# Altium schematic sheet 04 POWER.SchDoc
size 420 x 297 mm; Address1: Address1; Address2: Address2; Address3: Address3; Address4: Address4; DocumentNumber: АБВГ.123456.001 Э3; SheetNumber: 4; SheetTotal: 23; Scale: 1:1; DocumentType: Схема электрическая принципиальная; FirstReferrence: АБВГ.123456.001
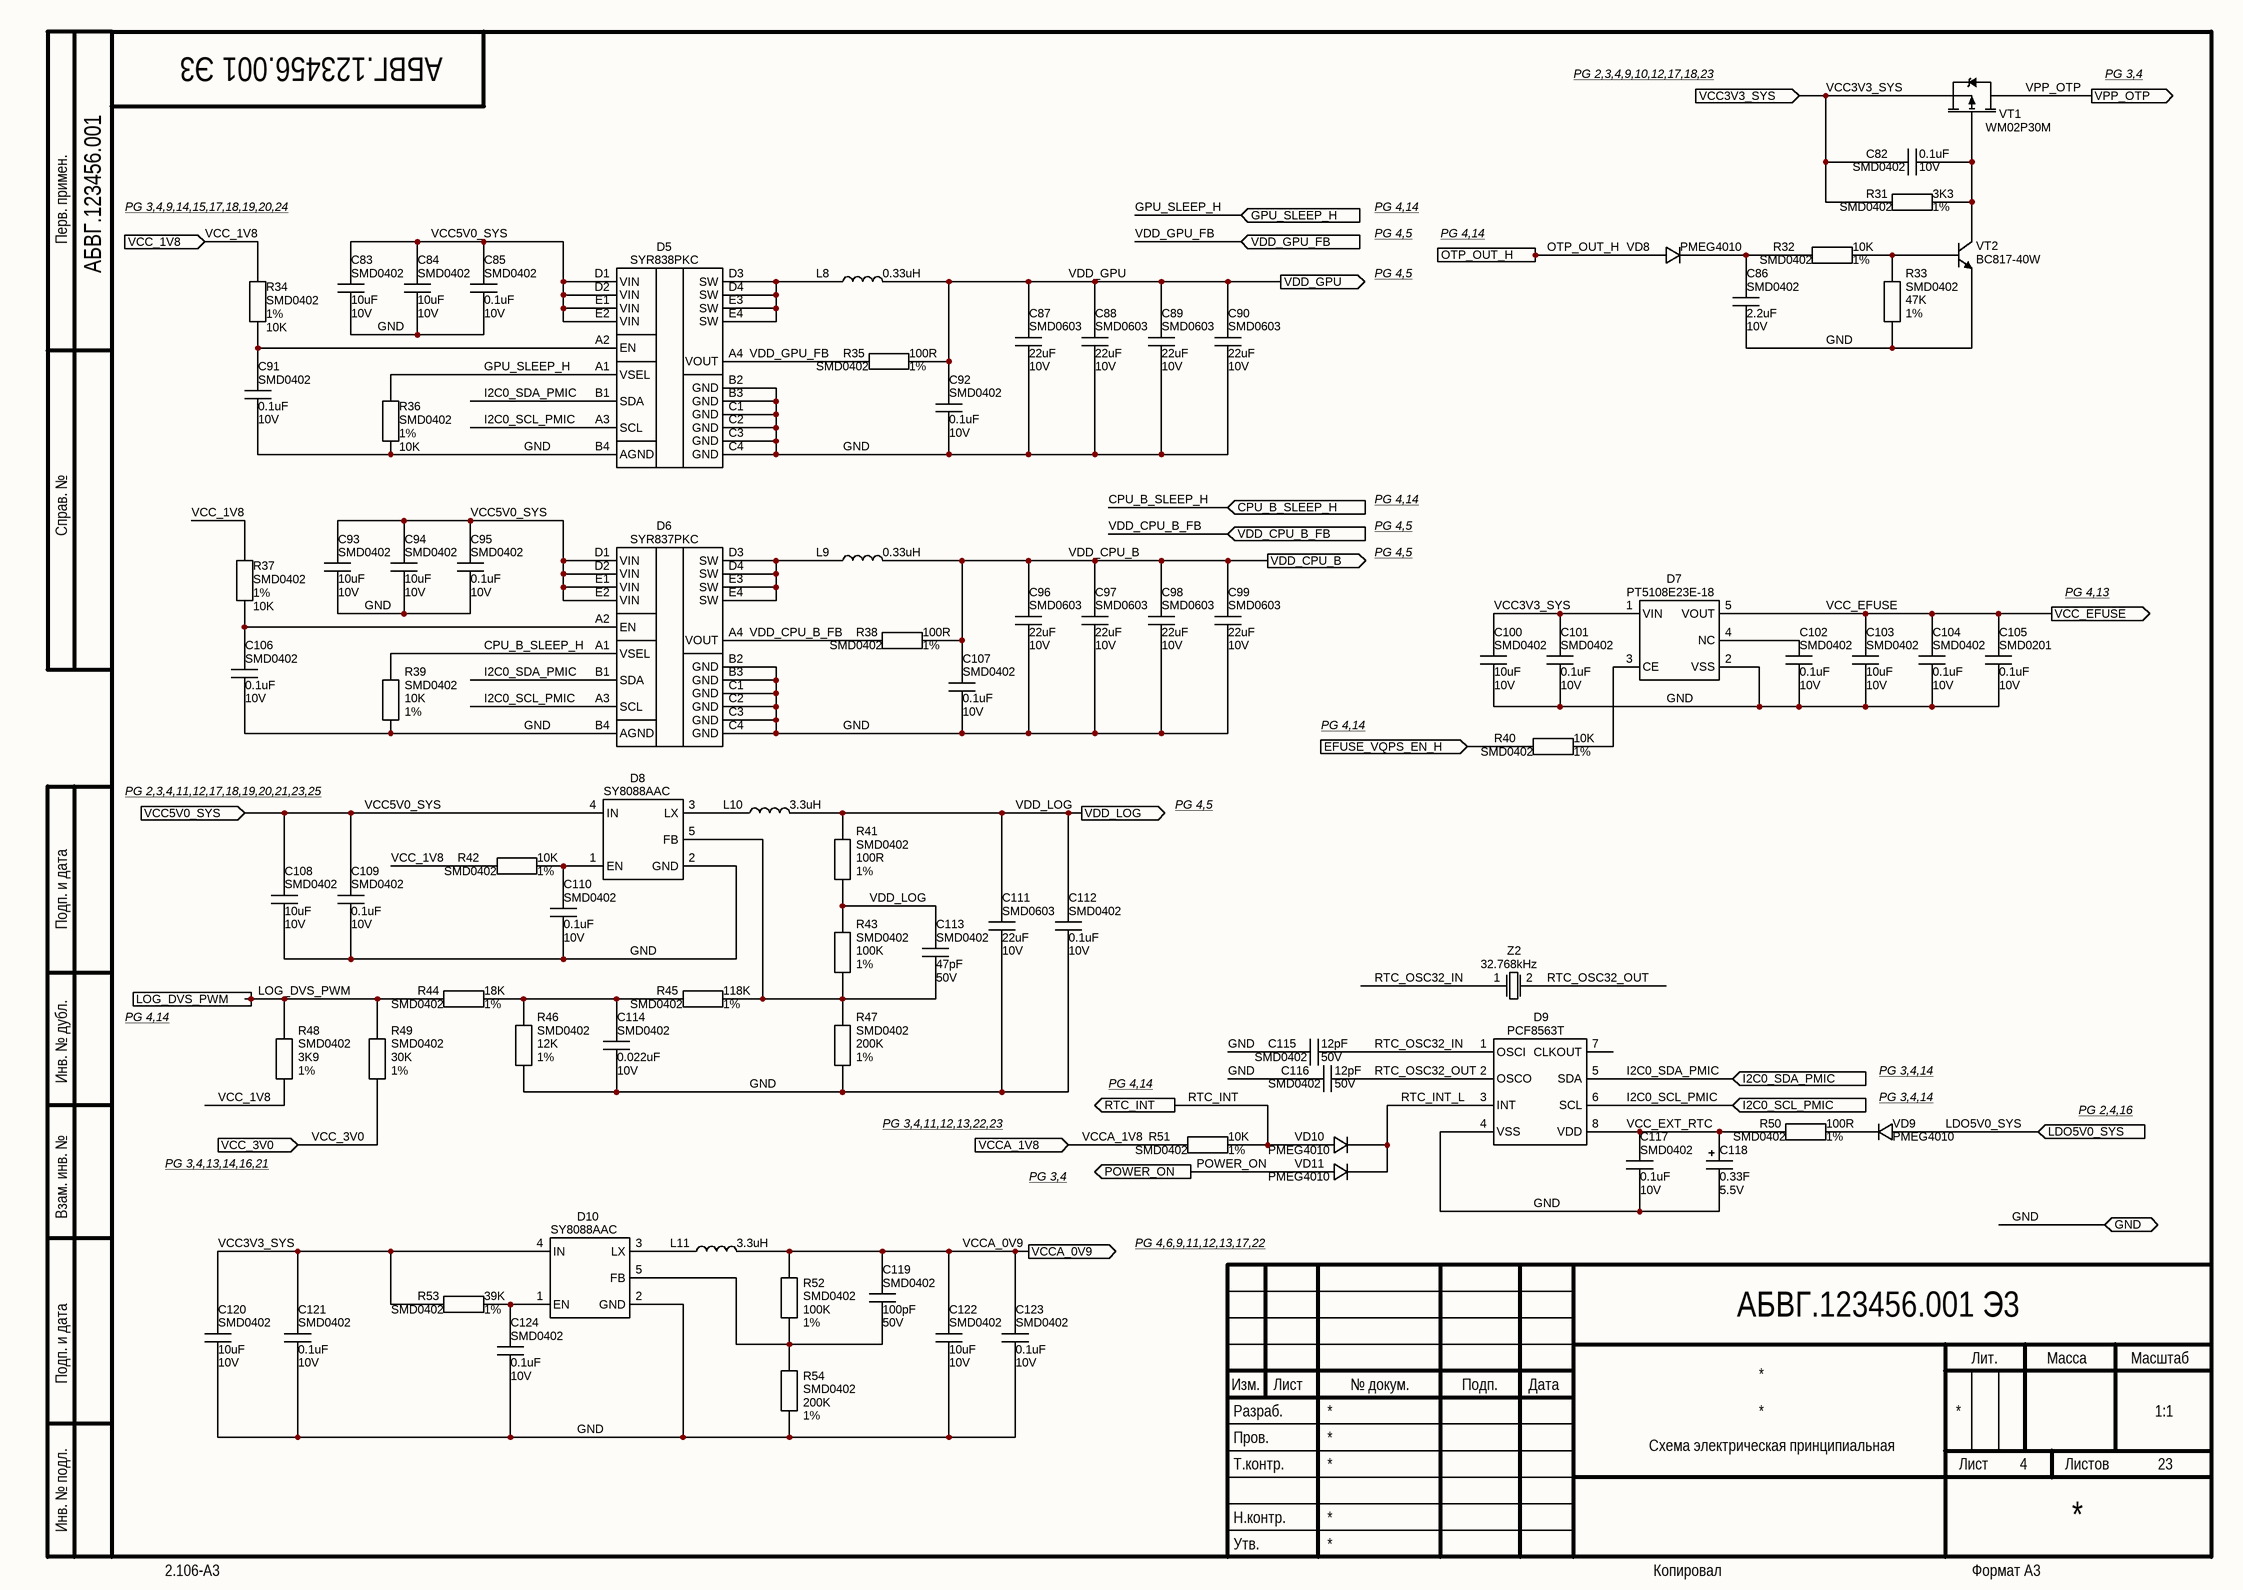
[diagram p0: 04 POWER.SchDoc]

## Parts
C82  Package: SMD0402  Voltage: 10V  [CAP_SMD_0402]  (hidden comment: 0.1uF)
C83  Package: SMD0402  Voltage: 10V  [CAP_SMD_0402]  (hidden comment: 10uF)
C84  Package: SMD0402  Voltage: 10V  [CAP_SMD_0402]  (hidden comment: 10uF)
C85  Package: SMD0402  Voltage: 10V  [CAP_SMD_0402]  (hidden comment: 0.1uF)
C86  Package: SMD0402  Voltage: 10V  [CAP_SMD_0402]  (hidden comment: 2.2uF)
C87  Package: SMD0603  Voltage: 10V  [CAP_SMD_0603]  (hidden comment: 22uF)
C88  Package: SMD0603  Voltage: 10V  [CAP_SMD_0603]  (hidden comment: 22uF)
C89  Package: SMD0603  Voltage: 10V  [CAP_SMD_0603]  (hidden comment: 22uF)
C90  Package: SMD0603  Voltage: 10V  [CAP_SMD_0603]  (hidden comment: 22uF)
C91  Package: SMD0402  Voltage: 10V  [CAP_SMD_0402]  (hidden comment: 0.1uF)
C92  Package: SMD0402  Voltage: 10V  [CAP_SMD_0402]  (hidden comment: 0.1uF)
C93  Package: SMD0402  Voltage: 10V  [CAP_SMD_0402]  (hidden comment: 10uF)
C94  Package: SMD0402  Voltage: 10V  [CAP_SMD_0402]  (hidden comment: 10uF)
C95  Package: SMD0402  Voltage: 10V  [CAP_SMD_0402]  (hidden comment: 0.1uF)
C96  Package: SMD0603  Voltage: 10V  [CAP_SMD_0603]  (hidden comment: 22uF)
C97  Package: SMD0603  Voltage: 10V  [CAP_SMD_0603]  (hidden comment: 22uF)
C98  Package: SMD0603  Voltage: 10V  [CAP_SMD_0603]  (hidden comment: 22uF)
C99  Package: SMD0603  Voltage: 10V  [CAP_SMD_0603]  (hidden comment: 22uF)
C100  Package: SMD0402  Voltage: 10V  [CAP_SMD_0402]  (hidden comment: 10uF)
C101  Package: SMD0402  Voltage: 10V  [CAP_SMD_0402]  (hidden comment: 0.1uF)
C102  Package: SMD0402  Voltage: 10V  [CAP_SMD_0402]  (hidden comment: 0.1uF)
C103  Package: SMD0402  Voltage: 10V  [CAP_SMD_0402]  (hidden comment: 10uF)
C104  Package: SMD0402  Voltage: 10V  [CAP_SMD_0402]  (hidden comment: 0.1uF)
C105  Package: SMD0201  Voltage: 10V  [CAP_SMD_0201]  (hidden comment: 0.1uF)
C106  Package: SMD0402  Voltage: 10V  [CAP_SMD_0402]  (hidden comment: 0.1uF)
C107  Package: SMD0402  Voltage: 10V  [CAP_SMD_0402]  (hidden comment: 0.1uF)
C108  Package: SMD0402  Voltage: 10V  [CAP_SMD_0402]  (hidden comment: 10uF)
C109  Package: SMD0402  Voltage: 10V  [CAP_SMD_0402]  (hidden comment: 0.1uF)
C110  Package: SMD0402  Voltage: 10V  [CAP_SMD_0402]  (hidden comment: 0.1uF)
C111  Package: SMD0603  Voltage: 10V  [CAP_SMD_0603]  (hidden comment: 22uF)
C112  Package: SMD0402  Voltage: 10V  [CAP_SMD_0402]  (hidden comment: 0.1uF)
C113  Package: SMD0402  Voltage: 50V  [CAP_SMD_0402]  (hidden comment: 47pF)
C114  Package: SMD0402  Voltage: 10V  [CAP_SMD_0402]  (hidden comment: 0.022uF)
C115  Package: SMD0402  Voltage: 50V  [CAP_SMD_0402]  (hidden comment: 12pF)
C116  Package: SMD0402  Voltage: 50V  [CAP_SMD_0402]  (hidden comment: 12pF)
C117  Package: SMD0402  Voltage: 10V  [CAP_SMD_0402]  (hidden comment: 0.1uF)
C118  Voltage: 5.5V  [DCS5R5_H]  (hidden comment: 0.33F)
C119  Package: SMD0402  Voltage: 50V  [CAP_SMD_0402]  (hidden comment: 100pF)
C120  Package: SMD0402  Voltage: 10V  [CAP_SMD_0402]  (hidden comment: 10uF)
C121  Package: SMD0402  Voltage: 10V  [CAP_SMD_0402]  (hidden comment: 0.1uF)
C122  Package: SMD0402  Voltage: 10V  [CAP_SMD_0402]  (hidden comment: 10uF)
C123  Package: SMD0402  Voltage: 10V  [CAP_SMD_0402]  (hidden comment: 0.1uF)
C124  Package: SMD0402  Voltage: 10V  [CAP_SMD_0402]  (hidden comment: 0.1uF)
D5  SYR838PKC  [WLCSP-20]
D6  SYR837PKC  [WLCSP-20]
D7  PT5108E23E-18  [SOT23-5]
D8  SY8088AAC  [SOT23-5]
D9  PCF8563T  [SO8]
D10  SY8088AAC  [SOT23-5]
L8  value 0.33uH  [HEI252012A]  (hidden comment: Value)
L9  value 0.33uH  [HEI252012A]  (hidden comment: Value)
L10  value 3.3uH  [HEI252012A]  (hidden comment: Value)
L11  value 3.3uH  [HEI252012A]  (hidden comment: Value)
R31  Package: SMD0402  Tolerance: 1%  [RES_SMD_0402]  (hidden comment: 3K3)
R32  Package: SMD0402  Tolerance: 1%  [RES_SMD_0402]  (hidden comment: 10K)
R33  Package: SMD0402  Tolerance: 1%  [RES_SMD_0402]  (hidden comment: 47K)
R34  Package: SMD0402  Tolerance: 1%  [RES_SMD_0402]  (hidden comment: 10K)
R35  Package: SMD0402  Tolerance: 1%  [RES_SMD_0402]  (hidden comment: 100R)
R36  Package: SMD0402  Tolerance: 1%  [RES_SMD_0402]  (hidden comment: 10K)
R37  Package: SMD0402  Tolerance: 1%  [RES_SMD_0402]  (hidden comment: 10K)
R38  Package: SMD0402  Tolerance: 1%  [RES_SMD_0402]  (hidden comment: 100R)
R39  Package: SMD0402  Tolerance: 1%  [RES_SMD_0402]  (hidden comment: 10K)
R40  Package: SMD0402  Tolerance: 1%  [RES_SMD_0402]  (hidden comment: 10K)
R41  Package: SMD0402  Tolerance: 1%  [RES_SMD_0402]  (hidden comment: 100R)
R42  Package: SMD0402  Tolerance: 1%  [RES_SMD_0402]  (hidden comment: 10K)
R43  Package: SMD0402  Tolerance: 1%  [RES_SMD_0402]  (hidden comment: 100K)
R44  Package: SMD0402  Tolerance: 1%  [RES_SMD_0402]  (hidden comment: 18K)
R45  Package: SMD0402  Tolerance: 1%  [RES_SMD_0402]  (hidden comment: 118K)
R46  Package: SMD0402  Tolerance: 1%  [RES_SMD_0402]  (hidden comment: 12K)
R47  Package: SMD0402  Tolerance: 1%  [RES_SMD_0402]  (hidden comment: 200K)
R48  Package: SMD0402  Tolerance: 1%  [RES_SMD_0402]  (hidden comment: 3K9)
R49  Package: SMD0402  Tolerance: 1%  [RES_SMD_0402]  (hidden comment: 30K)
R50  Package: SMD0402  Tolerance: 1%  [RES_SMD_0402]  (hidden comment: 100R)
R51  Package: SMD0402  Tolerance: 1%  [RES_SMD_0402]  (hidden comment: 10K)
R52  Package: SMD0402  Tolerance: 1%  [RES_SMD_0402]  (hidden comment: 100K)
R53  Package: SMD0402  Tolerance: 1%  [RES_SMD_0402]  (hidden comment: 39K)
R54  Package: SMD0402  Tolerance: 1%  [RES_SMD_0402]  (hidden comment: 200K)
VD8  value PMEG4010  [SOD323]  (hidden comment: Diode)
VD9  value PMEG4010  [SOD323]  (hidden comment: Diode)
VD10  value PMEG4010  [SOD323]  (hidden comment: Diode)
VD11  value PMEG4010  [SOD323]  (hidden comment: Diode)
VT1  value WM02P30M  [SOT23]  (hidden comment: Value)
VT2  BC817-40W  [SC-70]
Z2  value 32.768kHz  [TSX3215]  (hidden comment: Value)

## Ports
CPU_B_SLEEP_H (in), EFUSE_VQPS_EN_H (in), GND (bidir), GPU_SLEEP_H (in), I2C0_SCL_PMIC (in), I2C0_SDA_PMIC (in), LDO5V0_SYS (in), LOG_DVS_PWM (in), OTP_OUT_H (in), POWER_ON (out), RTC_INT (out), VCC3V3_SYS (in), VCC5V0_SYS (in), VCC_1V8 (in), VCC_3V0 (in), VCC_EFUSE (out), VCCA_0V9 (out), VCCA_1V8 (in), VDD_CPU_B (out), VDD_CPU_B_FB (in), VDD_GPU (out), VDD_GPU_FB (in), VDD_LOG (out), VPP_OTP (out)

## Nets
CPU_B_SLEEP_H: D6.A1(VSEL) R39.2 ; port CPU_B_SLEEP_H
EFUSE_VQPS_EN_H: R40.2 ; port EFUSE_VQPS_EN_H
GND: C83.2 C84.2 C85.2 C86.1 C87.1 C88.1 C89.1 C90.1 C91.2 C92.2 C93.2 C94.2 C95.2 C96.1 C97.1 C98.1 C99.1 C100.2 C101.2 C102.2 C103.2 C104.2 C105.2 C106.2 C107.2 C108.2 C109.2 C110.2 C111.1 C112.2 C114.2 C115.2 C116.2 C117.2 C118.2 C120.2 C121.2 C122.2 C123.2 C124.2 D5.B2(GND) D5.B3(GND) D5.B4(AGND) D5.C1(GND) D5.C2(GND) D5.C3(GND) D5.C4(GND) D6.B2(GND) D6.B3(GND) D6.B4(AGND) D6.C1(GND) D6.C2(GND) D6.C3(GND) D6.C4(GND) D7.2(VSS) D8.2(GND) D9.4(VSS) D10.2(GND) R33.1 R36.1 R39.1 R46.1 R47.1 R54.1 VT2.2(E) ; port GND
GPU_SLEEP_H: D5.A1(VSEL) R36.2 ; port GPU_SLEEP_H
I2C0_SCL_PMIC: D5.A3(SCL) D6.A3(SCL) D9.6(SCL) ; port I2C0_SCL_PMIC
I2C0_SDA_PMIC: D5.B1(SDA) D6.B1(SDA) D9.5(SDA) ; port I2C0_SDA_PMIC
LDO5V0_SYS: VD9.1(A) ; port LDO5V0_SYS
LOG_DVS_PWM: R44.1 R48.2 R49.2 ; port LOG_DVS_PWM
OTP_OUT_H: VD8.1(A) ; port OTP_OUT_H
POWER_ON: VD11.1(A) ; port POWER_ON
RTC_INT: R51.1 VD10.1(A) ; port RTC_INT
RTC_INT_L: D9.3(INT) VD10.2(C) VD11.2(C)
RTC_OSC32_IN: C115.1 D9.1(OSCI) Z2.1
RTC_OSC32_OUT: C116.1 D9.2(OSCO) Z2.2
VCC3V3_SYS: C82.1 C100.1 C101.1 C120.1 C121.1 D7.1(VIN) D10.4(IN) R31.1 R53.1 VT1.2(S) ; port VCC3V3_SYS
VCC5V0_SYS: C83.1 C84.1 C85.1 C93.1 C94.1 C95.1 C108.1 C109.1 D5.D1(VIN) D5.D2(VIN) D5.E1(VIN) D5.E2(VIN) D6.D1(VIN) D6.D2(VIN) D6.E1(VIN) D6.E2(VIN) D8.4(IN) ; port VCC5V0_SYS
VCC_1V8: R34.2 R37.2 R42.2 R48.1 ; port VCC_1V8
VCC_3V0: R49.1 ; port VCC_3V0
VCC_EFUSE: C103.1 C104.1 C105.1 D7.5(VOUT) ; port VCC_EFUSE
VCC_EXT_RTC: C117.1 C118.1 D9.8(VDD) R50.1
VCCA_0V9: C119.1 C122.1 C123.1 L11.1 R52.2 ; port VCCA_0V9
VCCA_1V8: R51.2 ; port VCCA_1V8
VDD_CPU_B: C96.2 C97.2 C98.2 C99.2 C107.1 L9.1 R38.2 ; port VDD_CPU_B
VDD_CPU_B_FB: D6.A4(VOUT) R38.1 ; port VDD_CPU_B_FB
VDD_GPU: C87.2 C88.2 C89.2 C90.2 C92.1 L8.1 R35.2 ; port VDD_GPU
VDD_GPU_FB: D5.A4(VOUT) R35.1 ; port VDD_GPU_FB
VDD_LOG: C111.2 C112.1 C113.1 L10.1 R41.1 R41.2 R43.2 ; port VDD_LOG
VPP_OTP: VT1.3(D) ; port VPP_OTP
NetC82_2: C82.2 R31.2 VT1.1(G) VT2.3(C)
NetC86_2: C86.2 R32.2 VD8.2(C)
NetC91_1: C91.1 D5.A2(EN) R34.1
NetC102_1: C102.1 D7.4(NC)
NetC106_1: C106.1 D6.A2(EN) R37.1
NetC110_1: C110.1 D8.1(EN) R42.1
NetC113_2: C113.2 D8.5(FB) R43.1 R45.2 R47.2
NetC114_1: C114.1 R44.2 R45.1 R46.2
NetC119_2: C119.2 D10.5(FB) R52.1 R54.2
NetC124_1: C124.1 D10.1(EN) R53.2
NetD5_D3: D5.D3(SW) D5.D4(SW) D5.E3(SW) D5.E4(SW) L8.2
NetD6_D3: D6.D3(SW) D6.D4(SW) D6.E3(SW) D6.E4(SW) L9.2
NetD7_3: D7.3(CE) R40.1
NetD8_3: D8.3(LX) L10.2
NetD10_3: D10.3(LX) L11.2
NetR32_1: R32.1 R33.2 VT2.1(B)
NetR50_2: R50.2 VD9.2(C)

Not connected (* = marked no-connect by the designer): D9 7(CLKOUT)

## Notes on the sheet
- PG 2,3,4,9,10,12,17,18,23
- PG 3,4
- Перв. примен.
- PG 3,4,9,14,15,17,18,19,20,24
- PG 4,14
- PG 4,5
- Справ. №
- PG 4,13
- PG 2,3,4,11,12,17,18,19,20,21,23,25
- Подп. и дата
- Инв. № дубл.
- PG 3,4,11,12,13,22,23
- PG 3,4,14
- (near VD9) PG 3,4,14
- PG 2,4,16
- PG 3,4,13,14,16,21
- Взам. инв. №
- PG 4,6,9,11,12,13,17,22
- Разраб.
- Изм.
- Лист
- № докум.
- Подп.
- Дата
- Лит.
- Масса
- Масштаб
- Пров.
- Т.контр.
- Листов
- Инв. № подл.
- Утв.
- Н.контр.
- 2.106-A3
- Копировал
- Формат А3

## Library data of the parts
C82 C85 C91 C92 C95 C101 C102 C104 C106 C107 C109 C110 C112 C117 C121 C123 C124 = Ceramic_Cap: PartNumber: CC0402KRX5R6BB104; ComponentType: SMD Ceramic Chip Capacitor; Manufacter: *; Tolerance: *; ClassName: *; Value: 0.1uF
C83 C84 C93 C94 C100 C103 C108 C120 C122 = Ceramic_Cap: PartNumber: CC0402MRX5R6BB106; ComponentType: SMD Ceramic Chip Capacitor; Manufacter: *; Tolerance: *; ClassName: *; Value: 10uF
C86 = Ceramic_Cap: PartNumber: CC0402KRX5R6BB225; ComponentType: SMD Ceramic Chip Capacitor; Manufacter: *; Tolerance: *; ClassName: *; Value: 2.2uF
C87-C90 C96-C99 C111 = Ceramic_Cap: PartNumber: CL10A226MP8NUNE; ComponentType: SMD Ceramic Chip Capacitor; Manufacter: *; Tolerance: *; ClassName: *; Value: 22uF
C105 = Ceramic_Cap: PartNumber: CC0201KRX5R6BB104; ComponentType: SMD Ceramic Chip Capacitor; Manufacter: *; Tolerance: *; ClassName: *; Value: 0.1uF
C113 = Ceramic_Cap: PartNumber: CC0402FRNPO9BN470; ComponentType: SMD Ceramic Chip Capacitor; Manufacter: *; Tolerance: *; ClassName: *; Value: 47pF
C114 = Ceramic_Cap: PartNumber: GRM155R61A223KA01D; ComponentType: SMD Ceramic Chip Capacitor; Manufacter: *; Tolerance: *; ClassName: *; Value: 0.022uF
C115 C116 = Ceramic_Cap: PartNumber: CC0402JRNPO9BN120; ComponentType: SMD Ceramic Chip Capacitor; Manufacter: *; Tolerance: *; ClassName: *; Value: 12pF
C118 = AluminiumCap: PartNumber: DCS5R5334HF; Tolerance: ±20%; Manufacturer: *; Package: DCS5R5_H; ComponentType: *; ClassName: *; Value: 0.33F
C119 = Ceramic_Cap: PartNumber: CC0402KRNPO9BN101; ComponentType: SMD Ceramic Chip Capacitor; Manufacter: *; Tolerance: *; ClassName: *; Value: 100pF
D6 = SYR838PKC: ComponentType: SMD Chip Resistor; Manufacter: *; Voltage: *; ClassName: *; Tolerance: *; PartNumber: SYR837PKC; Package: WLCSP-20; Value: SYR837PKC
D7 = PT5108E23E-30: ComponentType: SMD Chip Resistor; Manufacter: *; Voltage: *; ClassName: *; Tolerance: *; PartNumber: PT5108E23E-18; Package: SOT23-5; Value: PT5108E23E-18
L8 L9 = Inductor_smal: PartNumber: HEI252012A-R33M-Q8; ComponentType: *; Manufacter: *; Package: HEI252012A; ClassName: *
L10 L11 = Inductor_smal: PartNumber: WPN252012H3R3MT; ComponentType: *; Manufacter: *; Package: WPN252012; ClassName: *
R31 = Chip_Res: PartNumber: RC0402FR-073K3L; ComponentType: SMD Chip Resistor; Manufacter: *; Voltage: *; ClassName: *; Value: 3K3
R32 R34 R36 R37 R39 R40 R42 R51 = Chip_Res: PartNumber: RC0402FR-0710KL; ComponentType: SMD Chip Resistor; Manufacter: *; Voltage: *; ClassName: *; Value: 10K
R33 = Chip_Res: PartNumber: RC0402FR-1347KL; ComponentType: SMD Chip Resistor; Manufacter: *; Voltage: *; ClassName: *; Value: 47K
R35 R38 R41 R50 = Chip_Res: PartNumber: RC0402FR-07100RL; ComponentType: SMD Chip Resistor; Manufacter: *; Voltage: *; ClassName: *; Value: 100R
R43 R52 = Chip_Res: PartNumber: RC0402FR-07100KL; ComponentType: SMD Chip Resistor; Manufacter: *; Voltage: *; ClassName: *; Value: 100K
R44 = Chip_Res: PartNumber: RC0402FR-0718KL; ComponentType: SMD Chip Resistor; Manufacter: *; Voltage: *; ClassName: *; Value: 18K
R45 = Chip_Res: PartNumber: RC0402FR-07118KL; ComponentType: SMD Chip Resistor; Manufacter: *; Voltage: *; ClassName: *; Value: 118K
R46 = Chip_Res: PartNumber: RC0402FR-0712KL; ComponentType: SMD Chip Resistor; Manufacter: *; Voltage: *; ClassName: *; Value: 12K
R47 R54 = Chip_Res: PartNumber: RC0402FR-07200KL; ComponentType: SMD Chip Resistor; Manufacter: *; Voltage: *; ClassName: *; Value: 200K
R48 = Chip_Res: PartNumber: RC0402FR-073K9L; ComponentType: SMD Chip Resistor; Manufacter: *; Voltage: *; ClassName: *; Value: 3K9
R49 = Chip_Res: PartNumber: RC0402FR-0730KL; ComponentType: SMD Chip Resistor; Manufacter: *; Voltage: *; ClassName: *; Value: 30K
R53 = Chip_Res: PartNumber: RC0402FR-0739KL; ComponentType: SMD Chip Resistor; Manufacter: *; Voltage: *; ClassName: *; Value: 39K
VD8-VD11 = Diode: PartNumber: PMEG4010CEJ.115; ComponentType: *; Manufacter: *; Package: SOD323; ClassName: *
VT1 = MOSFET_P: ComponentType: *; Manufacter: *; Package: SOT23; PartNumber: WM02P30M; ClassName: *
VT2 = NPN_BEC: ComponentType: *; Manufacter: *; Package: SC-70; PartNumber: BC817-40W; ClassName: *; Value: BC817-40W
Z2 = OSC3215: PartNumber: SJK-7L-32.768-12.5-20-70-C; ComponentType: *; Manufacter: *; Package: TSX3215
D5 = SYR838PKC: ComponentType: SMD Chip Resistor; Manufacter: *; Voltage: *; ClassName: *; Tolerance: *; PartNumber: SYR838PKC; Package: WLCSP-20; Value: SYR838PKC
D8 D10 = SY8088AAC: ComponentType: SMD Chip Resistor; Manufacter: *; Voltage: *; ClassName: *; Tolerance: *; PartNumber: SY8088AAC; Package: SOT23-5; Value: SY8088AAC
D9 = PCF8563T: ComponentType: SMD Chip Resistor; Manufacter: *; Voltage: *; ClassName: *; Tolerance: *; PartNumber: PCF8563T; Package: SO8; Value: PCF8563T